# Altium schematic sheet P_Filter.SchDoc
size 220 x 165 mm
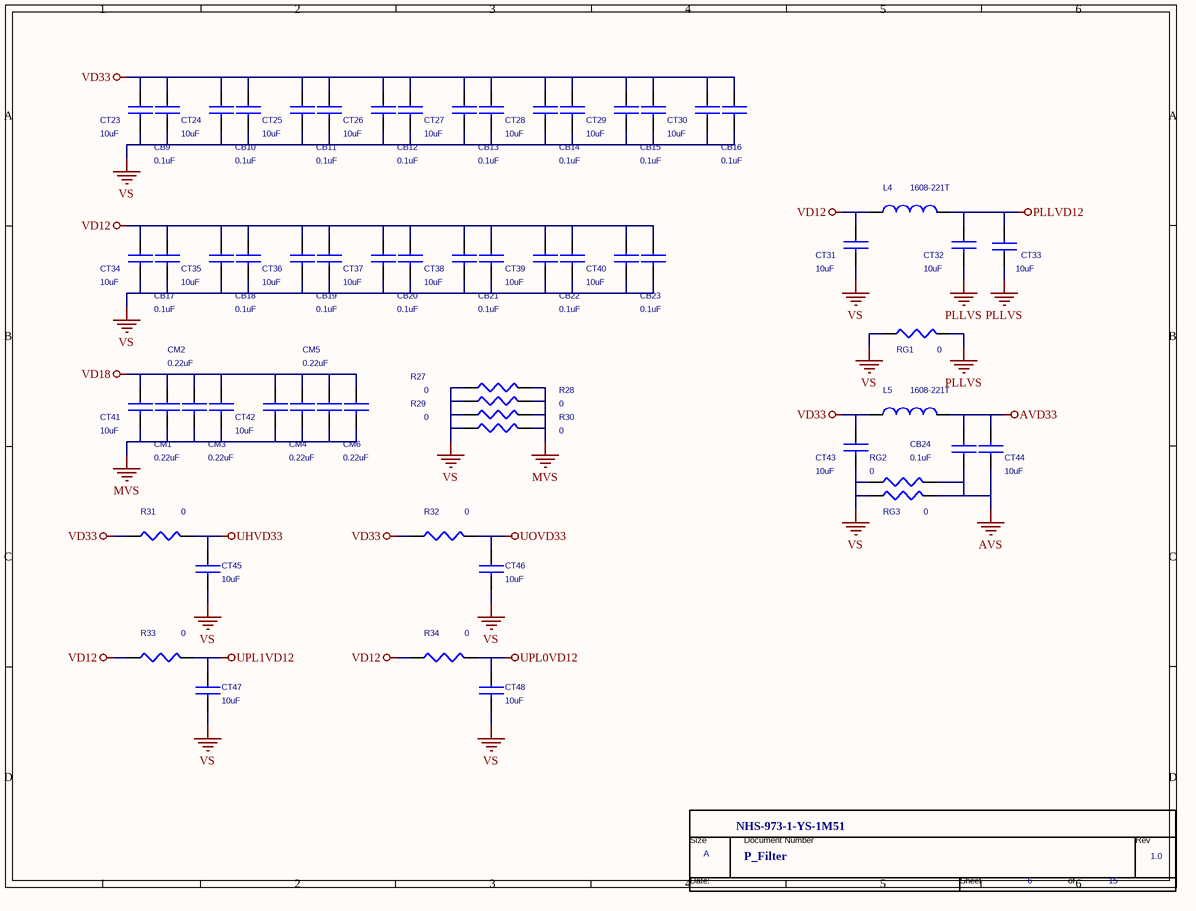
[diagram p0: P_Filter.SchDoc]

## Parts
*  RevCode: 1.0  Page Size: A  Page Number: 6  Page Count: 15  Doc: P_Filter  OrgName: NHS-973-1-YS-1M51  (hidden comment: TitleBlock0N)  (graphical)
CB9  0.1uF  [C0603]
CB10  0.1uF  [C0603]
CB11  0.1uF  [C0603]
CB12  0.1uF  [C0603]
CB13  0.1uF  [C0603]
CB14  0.1uF  [C0603]
CB15  0.1uF  [C0603]
CB16  0.1uF  [C0603]
CB17  0.1uF  [C0603]
CB18  0.1uF  [C0603]
CB19  0.1uF  [C0603]
CB20  0.1uF  [C0603]
CB21  0.1uF  [C0603]
CB22  0.1uF  [C0603]
CB23  0.1uF  [C0603]
CB24  0.1uF  [C0603]
CM1  0.22uF  [C0603]
CM2  0.22uF  [C0603]
CM3  0.22uF  [C0603]
CM4  0.22uF  [C0603]
CM5  0.22uF  [C0603]
CM6  0.22uF  [C0603]
CT23  10uF  [C0603]
CT24  10uF  [C0603]
CT25  10uF  [C0603]
CT26  10uF  [C0603]
CT27  10uF  [C0603]
CT28  10uF  [C0603]
CT29  10uF  [C0603]
CT30  10uF  [C0603]
CT31  10uF  [C0603]
CT32  10uF  [C0603]
CT33  10uF  [C0603]
CT34  10uF  [C0603]
CT35  10uF  [C0603]
CT36  10uF  [C0603]
CT37  10uF  [C0603]
CT38  10uF  [C0603]
CT39  10uF  [C0603]
CT40  10uF  [C0603]
CT41  10uF  [C0603]
CT42  10uF  [C0603]
CT43  10uF  [C0603]
CT44  10uF  [C0603]
CT45  10uF  [C0603]
CT46  10uF  [C0603]
CT47  10uF  [C0603]
CT48  10uF  [C0603]
L4  1608-221T  [L0603]
L5  1608-221T  [L0603]
R27  0  [R0603]
R28  0  [R0603]
R29  0  [R0603]
R30  0  [R0603]
R31  0  [R0603]
R32  0  [R0603]
R33  0  [R0603]
R34  0  [R0603]
RG1  0  [R0603]
RG2  0  [R0603]
RG3  0  [R0603]

## Nets
AVD33: CB24.2 CT44.2 L5.2
AVS: CB24.1 CT44.1 RG2.2 RG3.2
MVS: CM1.2 CM2.2 CM3.2 CM4.2 CM5.2 CM6.2 CT41.2 CT42.2 R27.1 R28.1 R29.1 R30.1
PLLVD12: CT32.1 CT33.2 L4.2
PLLVS: CT32.2 CT33.1 RG1.2
UHVD33: CT45.1 R31.1
UOVD33: CT46.1 R32.1
UPL0VD12: CT48.1 R34.1
UPL1VD12: CT47.1 R33.1
VD12: CB17.1 CB18.1 CB19.1 CB20.1 CB21.1 CB22.1 CB23.1 CT31.1 CT34.1 CT35.1 CT36.1 CT37.1 CT38.1 CT39.1 CT40.1 L4.1 R33.2 R34.2
VD18: CM1.1 CM2.1 CM3.1 CM4.1 CM5.1 CM6.1 CT41.1 CT42.1
VD33: CB9.1 CB10.1 CB11.1 CB12.1 CB13.1 CB14.1 CB15.1 CB16.1 CT23.1 CT24.1 CT25.1 CT26.1 CT27.1 CT28.1 CT29.1 CT30.1 CT43.1 L5.1 R31.2 R32.2
VS: CB9.2 CB10.2 CB11.2 CB12.2 CB13.2 CB14.2 CB15.2 CB16.2 CB17.2 CB18.2 CB19.2 CB20.2 CB21.2 CB22.2 CB23.2 CT23.2 CT24.2 CT25.2 CT26.2 CT27.2 CT28.2 CT29.2 CT30.2 CT31.2 CT34.2 CT35.2 CT36.2 CT37.2 CT38.2 CT39.2 CT40.2 CT43.2 CT45.2 CT46.2 CT47.2 CT48.2 R27.2 R28.2 R29.2 R30.2 RG1.1 RG2.1 RG3.1

## Notes on the sheet
- (in symbol TitleBlock0N) Size; Document Number; Rev; Date:; Sheet; of

## Library data of the parts
CB9-CB24 CM1-CM6 CT23-CT48 = CAP NP
L4 L5 = INDUCTOR
R27-R34 RG1-RG3 = R
* = TitleBlock0N: Page Create Date: April 25, 1995